# EAGLE design GRUBswitch_CustomHW_RevC (EAGLE 9.6.2)

## Sheet 1 of 2
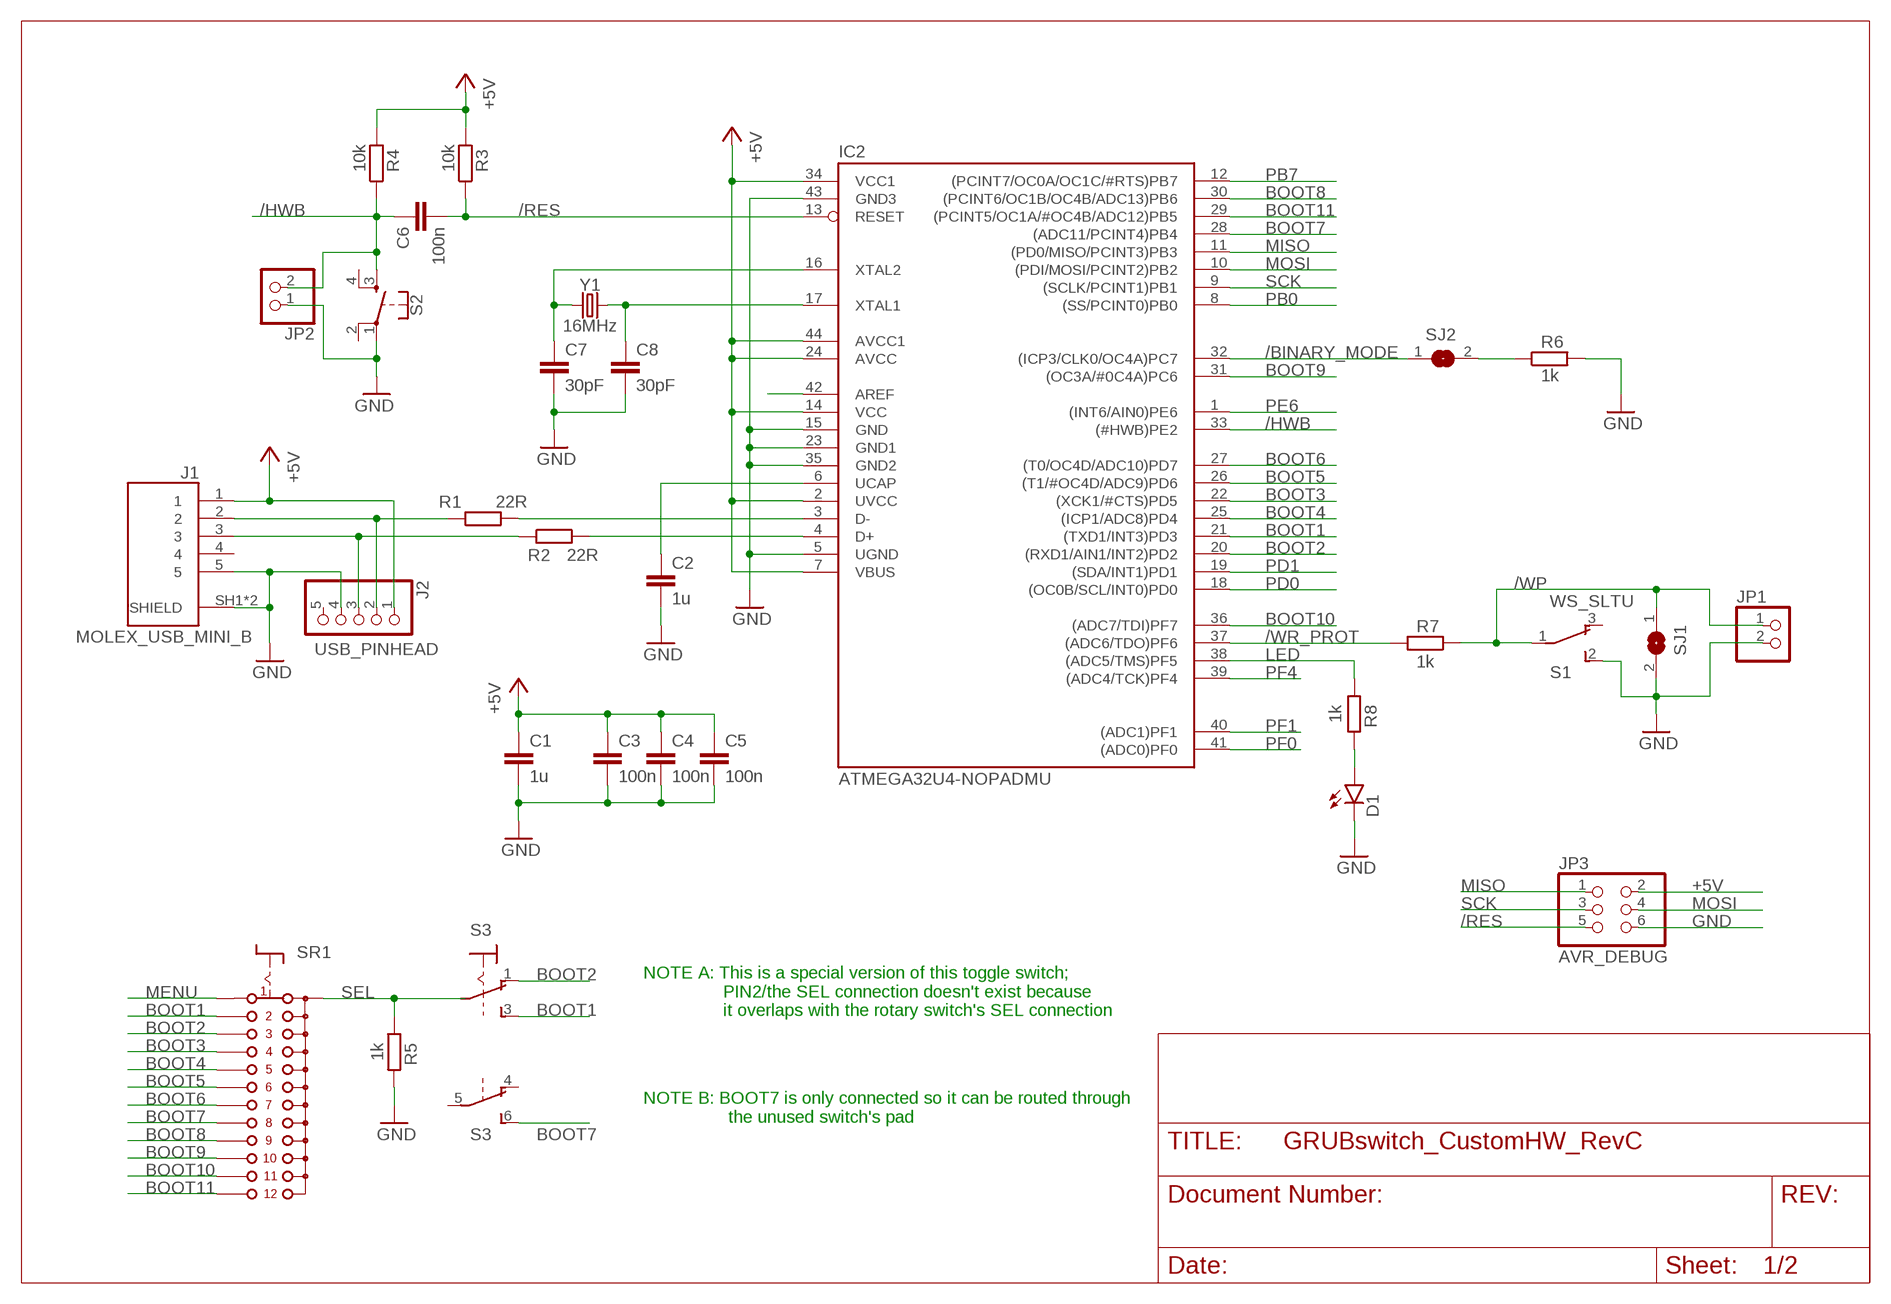
[diagram p0: schematic, sheet 1]

### Parts
C1  1u  C-EUC0805  [C0805]
C2  1u  C-EUC0805  [C0805]
C3  100n  C-EUC0805  [C0805]
C4  100n  C-EUC0805  [C0805]
C5  100n  C-EUC0805  [C0805]
C6  100n  C-EUC0805  [C0805]
C7  30pF  C-EUC0805  [C0805]
C8  30pF  C-EUC0805  [C0805]
D1  LEDCHIPLED_0805  [CHIPLED_0805]
IC2  ATMEGA32U4-NOPADMU  [QFN-44-NOPAD]
J1  MOLEX_USB_MINI_B  [MOLEX_502237-0517]
J2  USB_PINHEAD  PINHD-1X5  [1X05]
JP1  PINHD-1X2  [1X02]
JP2  PINHD-1X2  [1X02]
JP3  AVR_DEBUG  PINHD-2X3SMD  [2X03_SMD]
R1  22R  R-EU_R0805  [R0805]
R2  22R  R-EU_R0805  [R0805]
R3  10k  R-EU_R0805  [R0805]
R4  10k  R-EU_R0805  [R0805]
R5  1k  R-EU_R0805  [R0805]
R6  1k  R-EU_R0805  [R0805]
R7  1k  R-EU_R0805  [R0805]
R8  1k  R-EU_R0805  [R0805]
S1  WS_SLTU  [WS_SLTU]
S2  MOMENTARY-SWITCH-SPST-2-SMD-4.5MM  [TACTILE_SWITCH_SMD_4.5MM]
S3  M9040P2  [M9040P2]
SJ1  SJ  [SJ]
SJ2  SJ  [SJ]
SR1  CK101X12+  [CK101X12+]
Y1  16MHz  CRYSTALSMD-5X3.2-2PAD  [CRYSTAL-SMD-5X3.2-2PAD]

### Nets
+5V: C1.1 C3.1 C4.1 C5.1 IC2.2(UVCC) IC2.7(VBUS) IC2.14(VCC) IC2.24(AVCC) IC2.34(VCC1) IC2.44(AVCC1) J1.1 J2.1 JP3.2 R3.2 R4.2 ; also sheet 2
/BINARY_MODE: IC2.32((ICP3/CLK0/OC4A)PC7) SJ2.1 ; also sheet 2
/BM: R6.1 SJ2.2
/HWB: C6.1 IC2.33((#HWB)PE2) JP2.2 R4.1 S2.3 ; also sheet 2
/RES: C6.2 IC2.13(RESET) JP3.5 R3.1 ; also sheet 2
/WP: JP1.1 R7.1 S1.1(P) SJ1.1
/WR_PROT: IC2.37((ADC6/TDO)PF6) R7.2 ; also sheet 2
AREF: IC2.42(AREF) ; also sheet 2
BOOT1: IC2.21((TXD1/INT3)PD3) S3.3(1:S) SR1.2 ; also sheet 2
BOOT2: IC2.20((RXD1/AIN1/INT2)PD2) S3.1(1:O) SR1.3 ; also sheet 2
BOOT3: IC2.22((XCK1/#CTS)PD5) SR1.4 ; also sheet 2
BOOT4: IC2.25((ICP1/ADC8)PD4) SR1.5 ; also sheet 2
BOOT5: IC2.26((T1/#OC4D/ADC9)PD6) SR1.6 ; also sheet 2
BOOT6: IC2.27((T0/OC4D/ADC10)PD7) SR1.7 ; also sheet 2
BOOT7: IC2.28((ADC11/PCINT4)PB4) S3.6(2:S) SR1.8 ; also sheet 2
BOOT8: IC2.30((PCINT6/OC1B/OC4B/ADC13)PB6) SR1.9 ; also sheet 2
BOOT9: IC2.31((OC3A/#0C4A)PC6) SR1.10 ; also sheet 2
BOOT10: IC2.36((ADC7/TDI)PF7) SR1.11 ; also sheet 2
BOOT11: IC2.29((PCINT5/OC1A/#OC4B/ADC12)PB5) SR1.12 ; also sheet 2
D+: J1.3 J2.3 R2.1
D-: J1.2 J2.2 R1.1
GND: C1.2 C2.2 C3.2 C4.2 C5.2 C7.2 C8.2 D1.C IC2.5(UGND) IC2.15(GND) IC2.23(GND1) IC2.35(GND2) IC2.43(GND3) J1.5 J1.SH1(SHIELD) J1.SH2(SHIELD) J2.4 JP1.2 JP2.1 JP3.6 R5.2 R6.2 S1.2(S) S2.1 SJ1.2 ; also sheet 2
LED: IC2.38((ADC5/TMS)PF5) R8.2 ; also sheet 2
MENU: SR1.1
MISO: IC2.11((PD0/MISO/PCINT3)PB3) JP3.1 ; also sheet 2
MOSI: IC2.10((PDI/MOSI/PCINT2)PB2) JP3.4 ; also sheet 2
N$2: D1.A R8.1
PB0: IC2.8((SS/PCINT0)PB0) ; also sheet 2
PB7: IC2.12((PCINT7/OC0A/OC1C/#RTS)PB7) ; also sheet 2
PD0: IC2.18((OC0B/SCL/INT0)PD0) ; also sheet 2
PD1: IC2.19((SDA/INT1)PD1) ; also sheet 2
PE6: IC2.1((INT6/AIN0)PE6) ; also sheet 2
PF0: IC2.41((ADC0)PF0) ; also sheet 2
PF1: IC2.40((ADC1)PF1) ; also sheet 2
PF4: IC2.39((ADC4/TCK)PF4) ; also sheet 2
R_D+: IC2.4(D+) R2.2 ; also sheet 2
R_D-: IC2.3(D-) R1.2 ; also sheet 2
SCK: IC2.9((SCLK/PCINT1)PB1) JP3.3 ; also sheet 2
SEL: R5.1 SR1.A
UCAP: C2.1 IC2.6(UCAP) ; also sheet 2
XTAL1: C8.1 IC2.17(XTAL1) Y1.P$2 ; also sheet 2
XTAL2: C7.1 IC2.16(XTAL2) Y1.P$1 ; also sheet 2
Unconnected: J1.4 J2.5 S1.3(O) S2.2 S2.4 S3.4(2:O) S3.5(2:P)

### Notes on the sheet
- NOTE A: This is a special version of this toggle switch;
                  PIN2/the SEL connection doesn't exist because
                  it overlaps with the rotary switch's SEL connection
- NOTE B: BOOT7 is only connected so it can be routed through
                   the unused switch's pad

## Sheet 2 of 2
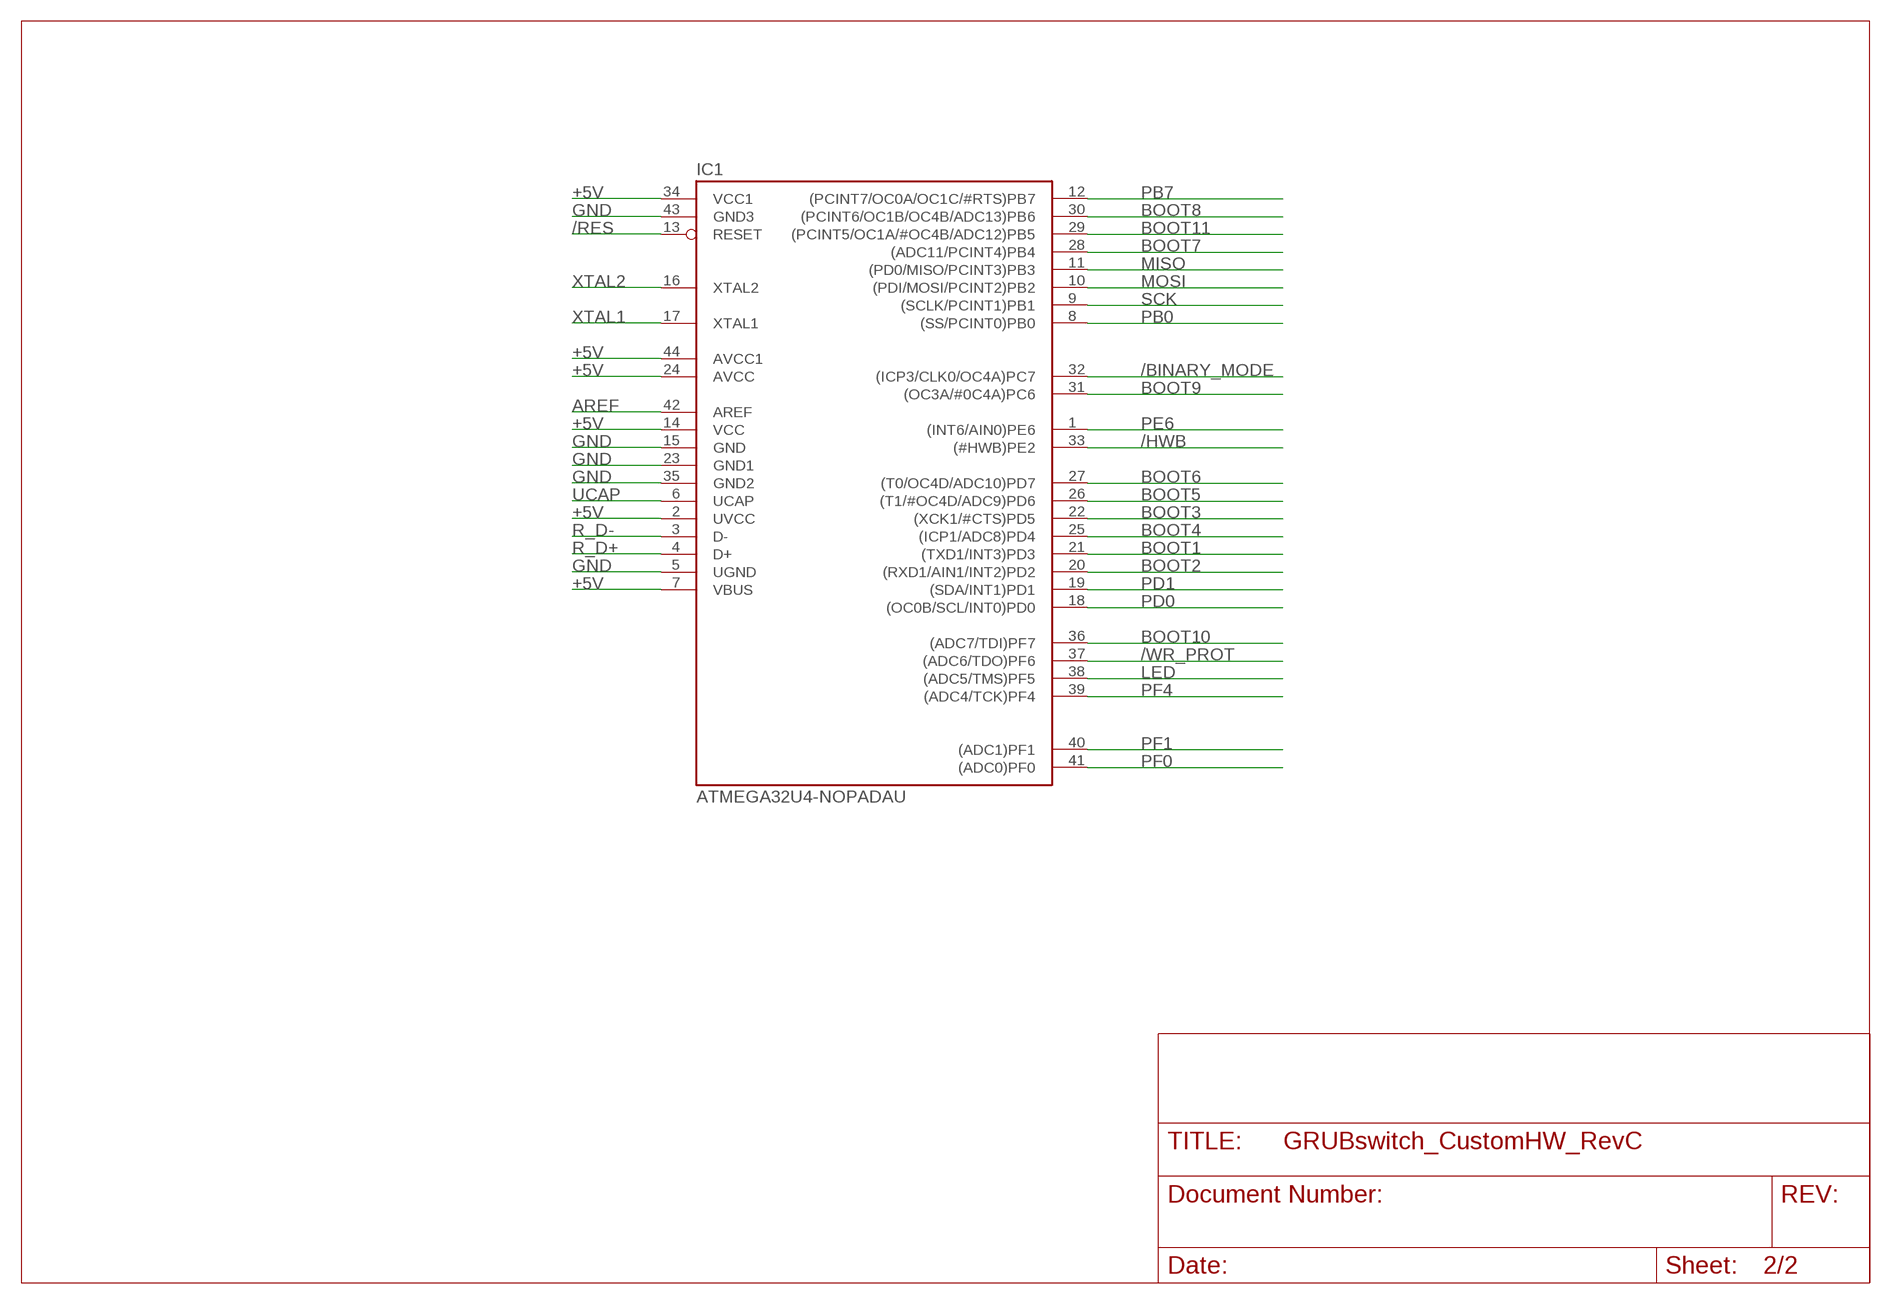
[diagram p1: schematic, sheet 2]

### Parts
IC1  ATMEGA32U4-NOPADAU  [TQFP44]

### Nets
+5V: IC1.2(UVCC) IC1.7(VBUS) IC1.14(VCC) IC1.24(AVCC) IC1.34(VCC1) IC1.44(AVCC1) ; also sheet 1
/BINARY_MODE: IC1.32((ICP3/CLK0/OC4A)PC7) ; also sheet 1
/HWB: IC1.33((#HWB)PE2) ; also sheet 1
/RES: IC1.13(RESET) ; also sheet 1
/WR_PROT: IC1.37((ADC6/TDO)PF6) ; also sheet 1
AREF: IC1.42(AREF) ; also sheet 1
BOOT1: IC1.21((TXD1/INT3)PD3) ; also sheet 1
BOOT2: IC1.20((RXD1/AIN1/INT2)PD2) ; also sheet 1
BOOT3: IC1.22((XCK1/#CTS)PD5) ; also sheet 1
BOOT4: IC1.25((ICP1/ADC8)PD4) ; also sheet 1
BOOT5: IC1.26((T1/#OC4D/ADC9)PD6) ; also sheet 1
BOOT6: IC1.27((T0/OC4D/ADC10)PD7) ; also sheet 1
BOOT7: IC1.28((ADC11/PCINT4)PB4) ; also sheet 1
BOOT8: IC1.30((PCINT6/OC1B/OC4B/ADC13)PB6) ; also sheet 1
BOOT9: IC1.31((OC3A/#0C4A)PC6) ; also sheet 1
BOOT10: IC1.36((ADC7/TDI)PF7) ; also sheet 1
BOOT11: IC1.29((PCINT5/OC1A/#OC4B/ADC12)PB5) ; also sheet 1
GND: IC1.5(UGND) IC1.15(GND) IC1.23(GND1) IC1.35(GND2) IC1.43(GND3) ; also sheet 1
LED: IC1.38((ADC5/TMS)PF5) ; also sheet 1
MISO: IC1.11((PD0/MISO/PCINT3)PB3) ; also sheet 1
MOSI: IC1.10((PDI/MOSI/PCINT2)PB2) ; also sheet 1
PB0: IC1.8((SS/PCINT0)PB0) ; also sheet 1
PB7: IC1.12((PCINT7/OC0A/OC1C/#RTS)PB7) ; also sheet 1
PD0: IC1.18((OC0B/SCL/INT0)PD0) ; also sheet 1
PD1: IC1.19((SDA/INT1)PD1) ; also sheet 1
PE6: IC1.1((INT6/AIN0)PE6) ; also sheet 1
PF0: IC1.41((ADC0)PF0) ; also sheet 1
PF1: IC1.40((ADC1)PF1) ; also sheet 1
PF4: IC1.39((ADC4/TCK)PF4) ; also sheet 1
R_D+: IC1.4(D+) ; also sheet 1
R_D-: IC1.3(D-) ; also sheet 1
SCK: IC1.9((SCLK/PCINT1)PB1) ; also sheet 1
UCAP: IC1.6(UCAP) ; also sheet 1
XTAL1: IC1.17(XTAL1) ; also sheet 1
XTAL2: IC1.16(XTAL2) ; also sheet 1

## Library data of the parts
C1-C8 = rcl:C-EU: CAPACITOR, European symbol; SPICEPREFIX: C
D1 = GRUB_Switch:LED: LED OSRAM: - CHIPLED LG R971, LG N971, LY N971, LG Q971, LY Q971, LO R971, LY R971 LH N974, LH R974 LS Q976, LO Q976, LY Q976 LO Q996 - Hyper CHIPLED LW Q18S LB Q993, LB Q99A, LB R99A - SideLED LS A670, LO A670, LY A670, LG A670, LP A670 LB A673, LV A673, LT A673, LW A673 LH A674 LY A675 LS A676, LA A676, LO A676, LY A676, LW A676 LS A679, LY A679, LG A679 - Hyper Micro SIDELED® LS Y876, LA Y876, LO Y876, LY Y876 LT Y87S - SmartLED LW L88C, LW L88S LB L89C, LB L89S, LG L890 LS L89K, LO L89K, LY L89K LS L896, LA L896, LO L896, LY L896 - TOPLED LS T670, LO T670, LY T670, LG T670, LP T670 LSG T670, LSP T670, LSY T670, LOP T670, LYG T670 LG T671, LOG T671, LSG T671 LB T673, LV T673, LT T673, LW T673 LH T674 LS T676, LA T676, LO T676, LY T676, LB T676, LH T676, LSB T676, LW T676 LB T67C, LV T67C, LT T67C, LS T67K, LO T67K, LY T67K, LW E67C LS E67B, LA E67B, LO E67B, LY E67B, LB E67C, LV E67C, LT E67C LW T67C LS T679, LY T679, LG T679 LS T770, LO T770, LY T770, LG T770, LP T770 LB T773, LV T773, LT T773, LW T773 LH T774 LS E675, LA E675, LY E675, LS T675 LS T776, LA T776, LO T776, LY T776, LB T776 LHGB T686 LT T68C, LB T68C - Hyper Mini TOPLED® LB M676 - Mini TOPLED Santana® LG M470 LS M47K, LO M47K, LY M47K Source: http://www.osram.convergy.de LUXEON: - LUMILED® LXK2-PW12-R00, LXK2-PW12-S00, LXK2-PW14-U00, LXK2-PW14-V00 LXK2-PM12-R00, LXK2-PM12-S00, LXK2-PM14-U00 LXK2-PE12-Q00, LXK2-PE12-R00, LXK2-PE12-S00, LXK2-PE14-T00, LXK2-PE14-U00 LXK2-PB12-K00, LXK2-PB12-L00, LXK2-PB12-M00, LXK2-PB14-N00, LXK2-PB14-P00, LXK2-PB14-Q00 LXK2-PR12-L00, LXK2-PR12-M00, LXK2-PR14-Q00, LXK2-PR14-R00 LXK2-PD12-Q00, LXK2-PD12-R00, LXK2-PD12-S00 LXK2-PH12-R00, LXK2-PH12-S00 LXK2-PL12-P00, LXK2-PL12-Q00, LXK2-PL12-R00 Source: www.luxeon.com KINGBRIGHT: KA-3528ASYC Source: www.kingbright.com
IC1 IC2 = GRUB_Switch:ATMEGA32U4-NOPAD
J1 = GRUB_Switch:MOLEX_USB_MINI_B: ZX Series 5 Position Right Angle PCB Wire Micro B USB Plug Check prices <https://pricing.snapeda.com/search/part/ZX62-B-5PA%2833%29/?ref=eda>
J2 = pinhead:PINHD-1X5: PIN HEADER
JP1 JP2 = pinhead:PINHD-1X2: PIN HEADER
JP3 = GRUB_Switch:PINHD-2X3: PIN HEADER
R1-R8 = rcl:R-EU_: RESISTOR, European symbol; SPICEPREFIX: R
S1 = GRUB_Switch:WS_SLTU
S2 = GRUB_Switch:MOMENTARY-SWITCH-SPST-2: Momentary Switch (Pushbutton) - SPST - Two Circuits Normally-open (NO) SPST momentary switches (buttons, pushbuttons). Schematic symbol includes two switch circuits. Variants SMD-4.6MMX2.8MM - 4.60mm x 2.80mm Tactile Momentary Button Switch - Used on SparkFun SAMD21 Mini Breakout <https://www.sparkfun.com/products/13664> SMD-5.2MM - Mini Pushbutton Switch - SMD <https://www.sparkfun.com/products/8720> - Used on Arduino Pro Mini <https://www.sparkfun.com/products/11114>
S3 = GRUB_Switch:M9040P2: TOGGLE SWITCH Marquardt
SJ1 SJ2 = jumper:SJ: SMD solder JUMPER
SR1 = GRUB_Switch:CK101X12: ROTARY SWITCH C&K
Y1 = GRUB_Switch:CRYSTAL: Crystals (Generic) These are passive quartz crystals, which can be used as a clock source for a microcontroller. Crystal's are two-terminal devices. They require external "load" capacitors to generate an oscillating signal.

## Board
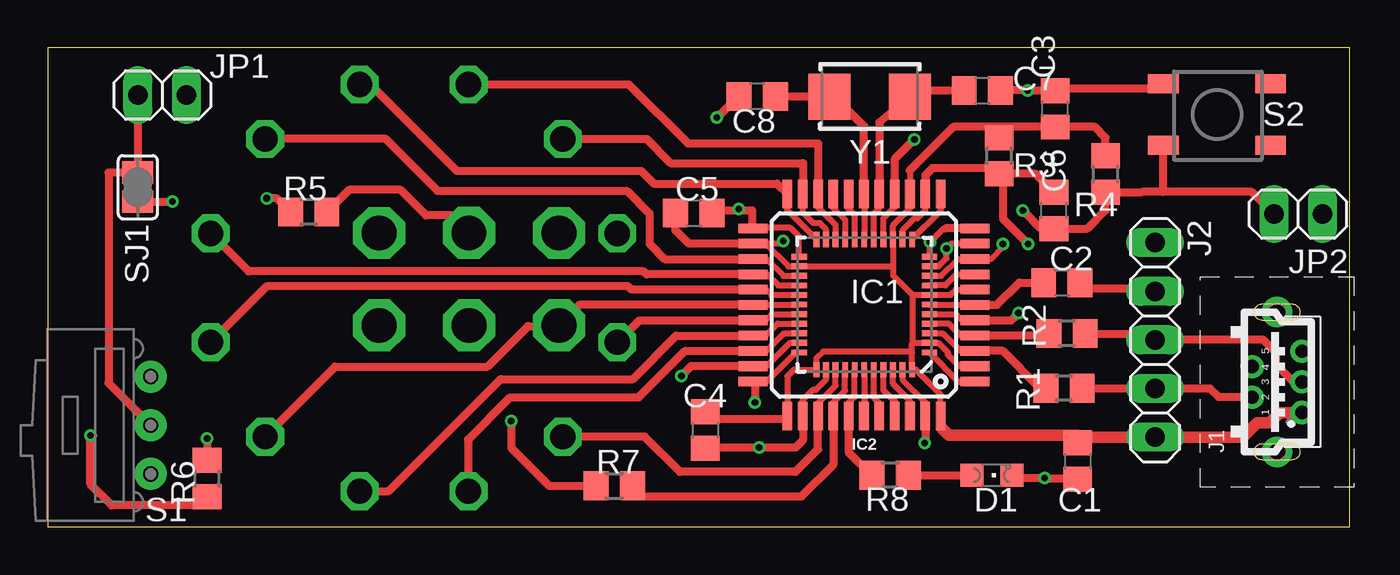
[diagram p2: board, top side]
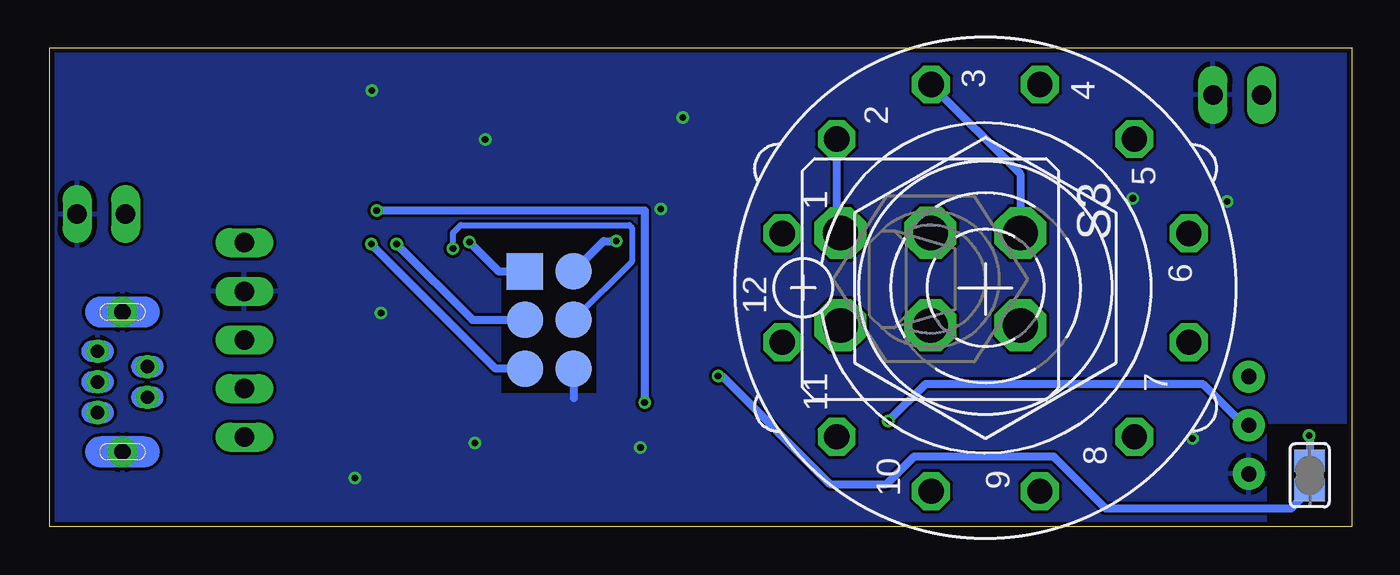
[diagram p3: board, bottom side, seen from below]

Size 68 x 25 mm. Coordinates in mm from the lower left corner, seen from the top.
Outline: 0,0 68,0 68,25 0,25 0,0
Copper layers (1*16): Top 0.035mm / dielectric 1.5mm / Bottom 0.035mm
Design rules "dirt_cheap_dirty_boards.v1.1": minimum track width 6mil, minimum drill 12mil, track to track 6mil, track to pad 6mil, pad to pad 6mil, via to via 6mil, smd to smd 0mil, copper to edge 10mil, drill to drill 10mil, minimum pad ring 10mil, minimum via ring 6mil, stop-mask expansion 2mil, vias tented up to drill 25mil, thermal gap 10mil

### Footprints (pad centres in the part's own frame; a part is rotated, then mirrored left to right if it is on the bottom)
C0805 = smd 1.3 x 1.5: 1 -0.95,0; 2 0.95,0
CHIPLED_0805 = smd 1.2 x 1.2: A 0,-1.05; C 0,1.05
TQFP44 = smd 1.5 x 0.5: 1 -5.8,4; 2 -5.8,3.2; 3 -5.8,2.4; 4 -5.8,1.6; 5 -5.8,0.8; 6 -5.8,0; 7 -5.8,-0.8; 8 -5.8,-1.6; 9 -5.8,-2.4; 10 -5.8,-3.2; 11 -5.8,-4; 23 5.8,-4; 24 5.8,-3.2; 25 5.8,-2.4; 26 5.8,-1.6; 27 5.8,-0.8; 28 5.8,0; 29 5.8,0.8; 30 5.8,1.6; 31 5.8,2.4; 32 5.8,3.2; 33 5.8,4 | smd 0.5 x 1.5: 12 -4,-5.8; 13 -3.2,-5.8; 14 -2.4,-5.8; 15 -1.6,-5.8; 16 -0.8,-5.8; 17 0,-5.8; 18 0.8,-5.8; 19 1.6,-5.8; 20 2.4,-5.8; 21 3.2,-5.8; 22 4,-5.8; 34 4,5.8; 35 3.2,5.8; 36 2.4,5.8; 37 1.6,5.8; 38 0.8,5.8; 39 0,5.8; 40 -0.8,5.8; 41 -1.6,5.8; 42 -2.4,5.8; 43 -3.2,5.8; 44 -4,5.8
QFN-44-NOPAD = smd 0.8 x 0.3: 1 -3.4,2.5; 2 -3.4,2; 3 -3.4,1.5; 4 -3.4,1; 5 -3.4,0.5; 6 -3.4,0; 7 -3.4,-0.5; 8 -3.4,-1; 9 -3.4,-1.5; 10 -3.4,-2; 11 -3.4,-2.5; 23 3.4,-2.5; 24 3.4,-2; 25 3.4,-1.5; 26 3.4,-1; 27 3.4,-0.5; 28 3.4,0; 29 3.4,0.5; 30 3.4,1; 31 3.4,1.5; 32 3.4,2; 33 3.4,2.5 | smd 0.3 x 0.8: 12 -2.5,-3.4; 13 -2,-3.4; 14 -1.5,-3.4; 15 -1,-3.4; 16 -0.5,-3.4; 17 0,-3.4; 18 0.5,-3.4; 19 1,-3.4; 20 1.5,-3.4; 21 2,-3.4; 22 2.5,-3.4; 34 2.5,3.4; 35 2,3.4; 36 1.5,3.4; 37 1,3.4; 38 0.5,3.4; 39 0,3.4; 40 -0.5,3.4; 41 -1,3.4; 42 -1.5,3.4; 43 -2,3.4; 44 -2.5,3.4
MOLEX_502237-0517 = drill 0.7 pad 1.1: 1 -1.6,-1.3; 2 -0.8,1.3; 3 0,-1.3; 4 0.8,1.3; 5 1.6,-1.3 | drill 0.85 pad 1.6: SH1 -3.65,0; SH2 3.65,0
1X05 = drill 1.016 long: 1 -5.08,0; 2 -2.54,0; 3 0,0; 4 2.54,0; 5 5.08,0
1X02 = drill 1.016 long: 1 -1.27,0; 2 1.27,0
2X03_SMD = smd 1.905 x 1.905: 1 -1.27,2.54; 2 1.27,2.54; 3 -1.27,0; 4 1.27,0; 5 -1.27,-2.54; 6 1.27,-2.54
R0805 = smd 1.3 x 1.5: 1 -0.95,0; 2 0.95,0
WS_SLTU = drill 0.8 pad 1.676: 1 0,0; 2 -2.54,0; 3 2.54,0
TACTILE_SWITCH_SMD_4.5MM = smd 1.6 x 1: 1 -2.8,1.6; 2 2.8,1.6; 3 -2.8,-1.6; 4 2.8,-1.6
M9040P2 = drill 1.803 octagon: 1 -2.413,4.699; 3 -2.413,-4.699; 4 2.413,4.699; 5 2.413,0; 6 2.413,-4.699
SJ = smd 1.168 x 1.6: 1 -0.762,0; 2 0.762,0
CK101X12+ = drill 1.321 octagon: 1 -2.845,-10.617; 2 -7.772,-7.772; 3 -10.617,-2.845; 4 -10.617,2.845; 5 -7.772,7.772; 6 -2.845,10.617; 7 2.845,10.617; 8 7.772,7.772; 9 10.617,2.845; 10 10.617,-2.845; 11 7.772,-7.772; 12 2.845,-10.617 | drill 1.803 octagon: A -2.87,-2.87
CRYSTAL-SMD-5X3.2-2PAD = smd 2.2 x 2.4: P$1 2.1,0; P$2 -2.1,0

### Placement (x,y rotation side)
C1  53.8,3.43 270 top
C2  52.96,12.74 0 top
C3  52.62,21.82 90 top
C4  34.34,5.04 270 top
C5  33.73,16.38 0 top
C6  52.55,16.51 90 top
C7  48.81,22.78 0 top
C8  37.06,22.46 180 top
D1  49.31,2.68 270 top
IC1  42.63,11.58 180 top
IC2  42.64,11.6 180 top
J1  64.2,7.56 90 top
J2  57.84,9.75 90 top
JP1  5.97,22.54 0 top
JP2  65.31,16.32 180 top
JP3  41.91,10.79 0 bottom
R1  53.07,7.23 180 top
R2  53.23,10.09 180 top
R3  49.69,19.37 90 top
R4  55.24,18.41 90 top
R5  13.62,16.43 180 top
R6  8.32,2.51 90 top
R7  29.59,2.13 0 top
R8  44,2.68 180 top
S1  5.37,5.3 90 top
S2  61.07,21.52 0 top
S3  22,12.92 270 bottom
SJ1  4.7,17.73 270 top
SJ2  2.19,2.68 90 bottom
SR1  19.12,12.47 270 bottom
Y1  42.93,22.46 0 top

### Tracks (layer width: path | path; a pad name or v marks a point on that pad's centre or on a via)
+5V  (via drill 0.35)
  Top 0.305: R3.2 49.85,20.48 49.85,20.87 | 37.5,14.78 38.68,13.6 IC2.24 44.13,13.6 44.14,13.61 | IC2.44 45.35,8.2 46.63,6.91 IC1.44 | 45.16,12.1 IC2.7 47.15,12.1 47.43,12.38 IC1.7 | 45.16,12.1 45.16,9.6 | 45.16,12.1 44.14,13.12 44.14,13.61 | 44.14,13.61 IC2.14 44.14,15.75 45.06,16.66 45.06,17.34 IC1.14 45.03,18.6 | 37.5,14.78 38.27,14.78 v38.41,14.91 | 45.16,9.6 IC2.2 46.52,9.6 47,9.12 47,8.98 47.61,8.38 IC1.2 | IC2.44 45.14,9.1 45.1,9.14 40.49,9.14 40.13,8.79 IC2.34 38.98,8.2 38.63,7.84 IC1.34 38.47,5.61 | IC2.44 45.14,9.58 45.16,9.6 | 37.5,14.78 IC1.24
  Top 0.406: IC1.24 33.48,14.78 32.78,15.48 C5.1 | 45.03,18.6 47.3,20.87 49.85,20.87 C3.1 54.69,20.87 55.24,20.32 R4.2 | 38.47,5.61 34.72,5.61 C4.1 | 46.69,5.14 46.63,5.21 IC1.44
  Top 0.61: J1.1 64.35,5.96 63.82,5.43 63.18,5.43 62.43,4.67 J2.1 53.8,4.67 C1.1 53.78,4.39 53.78,4.76 47.07,4.76 46.69,5.14
  Bottom 0.406: JP3.2 39.06,14.91 v38.41,14.91
/BINARY_MODE  (via drill 0.35)
  Top 0.305: IC1.32 37.53,8.38 38.76,9.6 IC2.32
  Top 0.406: IC1.32 33.6,8.38 v33.1,7.87
  Bottom 0.406: v33.1,7.87 32.89,7.87 27.24,2.22 24.29,2.22 22.86,3.65 15.56,3.65 12.86,0.95 3.16,0.95 SJ2.1
/BM  (via drill 0.35)
  Top 0.406: R6.1 7.87,1.11 3.33,1.11 2.22,2.22 v2.22,4.76
  Bottom 0.406: v2.22,4.76 2.19,4.73 SJ2.2
/HWB  (via drill 0.35)
  Top 0.305: IC1.33 37.54,7.57 39.07,9.1 IC2.33
  Top 0.406: S2.3 58.27,17.53 58.22,17.48 | JP2.2 62.88,17.48 58.22,17.48 | 58.22,17.48 57.17,17.48 57.15,17.46 R4.1 55.24,16.51 54.3,15.56 C6.1 51.88,15.56 v50.93,16.51 | IC1.33 36.93,7.47 v36.93,6.48
  Bottom 0.406: v50.93,16.51 36.93,16.51 v36.93,6.48
/RES  (via drill 0.35)
  Top 0.305: IC2.13 44.64,15.48 45.26,16.1 45.41,16.1 45.83,16.52 IC1.13
  Top 0.406: R3.1 49.39,18.72 46.2,18.72 45.83,18.34 IC1.13 | C6.2 51.59,18.42 R3.1 | v51.21,14.76 49.91,16.05 49.91,18.2 R3.1
  Bottom 0.406: v51.21,14.76 44.7,8.26 JP3.5
/WP  (via drill 0.35)
  Top 0.406: JP1.1 SJ1.1 3.17,18.49 3.17,7.49 S1.1 | R7.1 26.18,2.13 24.2,4.11 v24.2,5.52
  Bottom 0.406: v24.2,5.52 22.25,7.46 7.78,7.46 5.61,5.3 S1.1
/WR_PROT
  Top 0.305: IC1.37 41.03,6.48 41.64,7.1 IC2.37
  Top 0.406: IC1.37 41.03,3.25 39.37,1.59 31.08,1.59 R7.2
AREF
  Top 0.305: IC1.42 45.03,6.58 44.14,7.47 IC2.42
BOOT1
  Top 0.305: 39.45,17.39 39.45,16.38 39.98,15.85 40.34,15.85 40.64,15.54 IC2.21
  Top 0.406: IC1.21 39.45,17.39 39.45,18.99 32.53,18.99 31.28,20.24 SR1.2
  Bottom 0.406: SR1.2 26.9,15.53 S3.3
BOOT2
  Top 0.305: IC1.20 40.23,16.67 41.14,15.75 IC2.20
  Top 0.406: SR1.3 30.36,23.09 33.43,20.01 40.23,20.01 IC1.20
  Bottom 0.406: SR1.3 17.3,18.42 S3.1
BOOT3
  Top 0.305: IC1.22 38.63,16.51 IC2.22
  Top 0.406: SR1.4 16.85,23.09 21.36,18.58 30.99,18.58 31.65,17.91 38.09,17.91 IC1.22
BOOT4
  Top 0.305: IC1.25 37.53,13.98 38.41,13.1 IC2.25
  Top 0.406: SR1.5 17.64,20.24 20.35,17.53 30.25,17.53 31.43,16.35 31.43,14.76 32.22,13.98 IC1.25
BOOT5
  Top 0.305: IC1.26 37.57,13.18 38.15,12.6 IC2.26
  Top 0.406: IC1.26 31.27,13.18 31.11,13.34 10.49,13.34 SR1.6
BOOT6
  Top 0.305: IC1.27 36.9,12.45 37.44,12.45 37.79,12.1 IC2.27
  Top 0.406: IC1.27 30.49,12.38 30.32,12.54 11.42,12.54 SR1.7
BOOT7
  Top 0.305: IC1.28 36.85,11.6 IC2.28
  Top 0.406: SR1.8 15.01,8.35 22.95,8.35 25.08,10.48 26.67,10.48 S3.6 27.77,11.58 IC1.28
BOOT8
  Top 0.305: IC1.30 36.85,9.96 37.49,9.96 38.13,10.6 IC2.30
  Top 0.406: SR1.9 17.8,1.85 23.66,7.71 30.55,7.71 32.82,9.98 IC1.30
BOOT9
  Top 0.305: IC1.31 36.86,9.14 37.49,9.14 38.44,10.1 IC2.31
  Top 0.406: SR1.10 21.94,1.88 21.94,4.54 24.15,6.75 30.86,6.75 33.28,9.18 IC1.31
BOOT10
  Top 0.305: IC1.36 40.23,6.45 41.14,7.36 IC2.36
  Top 0.406: SR1.11 31.17,4.7 33.01,2.86 39.05,2.86 40.23,4.04 IC1.36
BOOT11
  Top 0.305: IC1.29 37.49,10.77 37.82,11.1 IC2.29
  Top 0.406: IC1.29 30.89,10.78 SR1.12
D+
  Top 0.406: R2.1 57.5,10.09 J2.3 63.5,9.75 64.14,9.12 64.14,8.48 65.02,7.59 65.47,7.59 J1.3
D-
  Top 0.406: R1.1 57.82,7.23 J2.2 60.7,7.21 61.15,6.76 J1.2
GND  (via drill 0.35)
  Top 0.152: IC1.5 48.37,10.72 | IC1.15 44.23,16.67 | IC1.23 36.8,15.61
  Top 0.305: IC2.23 39.24,15.16 38.8,15.61 36.8,15.61 | IC2.15 43.64,16.08 44.23,16.67 | IC2.5 47.42,11.1 47.8,10.72 48.37,10.72 | IC2.43 44.64,7.68 45.83,6.5 IC1.43 | IC2.35 40.64,7.67 40.11,7.14 39.95,7.14 39.42,6.6 IC1.35
  Top 0.406: 36.09,16.51 v36.09,16.59 | J2.4 57.71,12.42 54.23,12.42 C2.2 | C5.2 34.61,16.51 36.09,16.51 | 36.09,16.51 36.8,16.51 36.8,15.61 | C8.2 36.04,22.46 v34.95,21.36 | C4.2 34.37,4.13 v37.15,4.13 39.05,4.13 39.43,4.5 IC1.35 | C7.2 v51.17,22.78 C3.2 52.7,22.86 58.32,22.86 58.32,23.07 S2.1 | C1.2 53.73,2.54 v52.07,2.54 50.5,2.54 D1.C | R5.2 11.96,17.14 v11.43,17.14 | v8.32,4.6 R6.2 | SJ1.2 6.49,16.97 v6.51,16.99 | IC1.5 50.32,10.78 v50.7,11.15 | v45.26,20.22 44.23,19.18 IC1.15 | IC1.43 45.83,4.4 v45.8,4.37
  Bottom 0.406: JP3.6 40.64,6.73
  pour Bottom: 0,0 68,0 68,25 0,25
  cutout Bottom: 4.4,5.32 4.4,0.03 -0.03,0.03 -0.03,5.32
  cutout Bottom: 44.41,14.6 44.41,7.01 39.46,7.01 39.46,14.6
LED
  Top 0.305: IC1.38 41.83,6.47 42.14,6.79 IC2.38
  Top 0.406: IC1.38 41.83,3.89 43.04,2.68 R8.2
MISO  (via drill 0.35)
  Top 0.305: 46.89,15.58 46.79,15.58 v46.08,14.86 46.04,14.83 IC2.11
  Top 0.406: IC1.11 46.89,15.58
  Bottom 0.406: v46.08,14.86 44.55,13.34 JP3.1
MOSI  (via drill 0.35)
  Top 0.305: IC1.10 47.19,14.78 v46.94,14.53 46.94,14.01 46.52,13.6 IC2.10
  Bottom 0.305: v46.94,14.53 46.94,15.34 46.53,15.75 37.74,15.75 37.59,15.6 37.59,13.84 JP3.4
N$2
  Top 0.406: R8.1 D1.A
PB0
  Top 0.305: IC1.8 47.47,13.18 46.89,12.6 IC2.8
PB7
  Top 0.305: IC1.12 46.63,16.48 IC2.12
PD0
  Top 0.305: IC1.18 41.78,17.33 41.78,16.64 42.14,16.28 IC2.18
PD1
  Top 0.305: IC1.19 41.02,16.64 41.64,16.02 IC2.19
PE6
  Top 0.305: IC1.1 47.56,7.58 IC2.1
PF0
  Top 0.305: IC1.41 44.25,5.79 44.25,6.53 43.64,7.13 IC2.41
PF1
  Top 0.305: IC1.40 43.43,6.45 43.14,6.74 IC2.40
PF4
  Top 0.305: IC1.39 42.64,5.79 IC2.39
R_D+
  Top 0.305: IC1.4 48.41,9.96 47.7,9.96 47.06,10.6 IC2.4
  Top 0.406: IC1.4 52.17,9.98 R2.2
R_D-
  Top 0.305: IC2.3 46.75,10.1 47.67,9.18 IC1.3
  Top 0.406: R1.2 51.83,7.23 49.88,9.18 IC1.3
SCK  (via drill 0.35)
  Top 0.305: v49.89,14.76 49.89,14.58 49.28,13.98 IC1.9 47.55,13.98 46.66,13.09 46.05,13.09 IC2.9
  Bottom 0.406: v49.89,14.76 45.92,10.79 JP3.3
SEL
  Top 0.406: R5.1 15.73,17.59 18.41,17.59 19.75,16.26 21.08,16.26 SR1.A
UCAP
  Top 0.305: IC1.6 48.41,11.6 IC2.6
  Top 0.406: IC1.6 49.58,11.58 50.74,12.74 C2.1
XTAL1
  Top 0.305: IC2.17 42.64,17.37 IC1.17
  Top 0.406: IC1.17 42.63,20.91 41.08,22.46 Y1.P$2 C8.1
XTAL2
  Top 0.305: IC2.16 43.14,16.35 43.43,16.64 IC1.16
  Top 0.406: C7.1 45.1,22.78 Y1.P$1 43.43,21.1 IC1.16

### Text on the board
top_silk: →WR_PROT | 3 | 2 | PROG | 4 | 1 | 5 | 1/n-mode | n | . | c | . | G | N | D | 6 | 11 | 6510 | D+ | D- | 7 | 10 | 8 | 5V | 9
bottom_silk: THE GRUB SWITCH | 4 | 2 | 8 | 1 | Custom Hardware Rev.C | n.c. | 2 | 1 | GND | D+ | Binary mode | D- | ISP | 5V